# Altium schematic sheet 8Relay.SchDoc
size A1 portrait
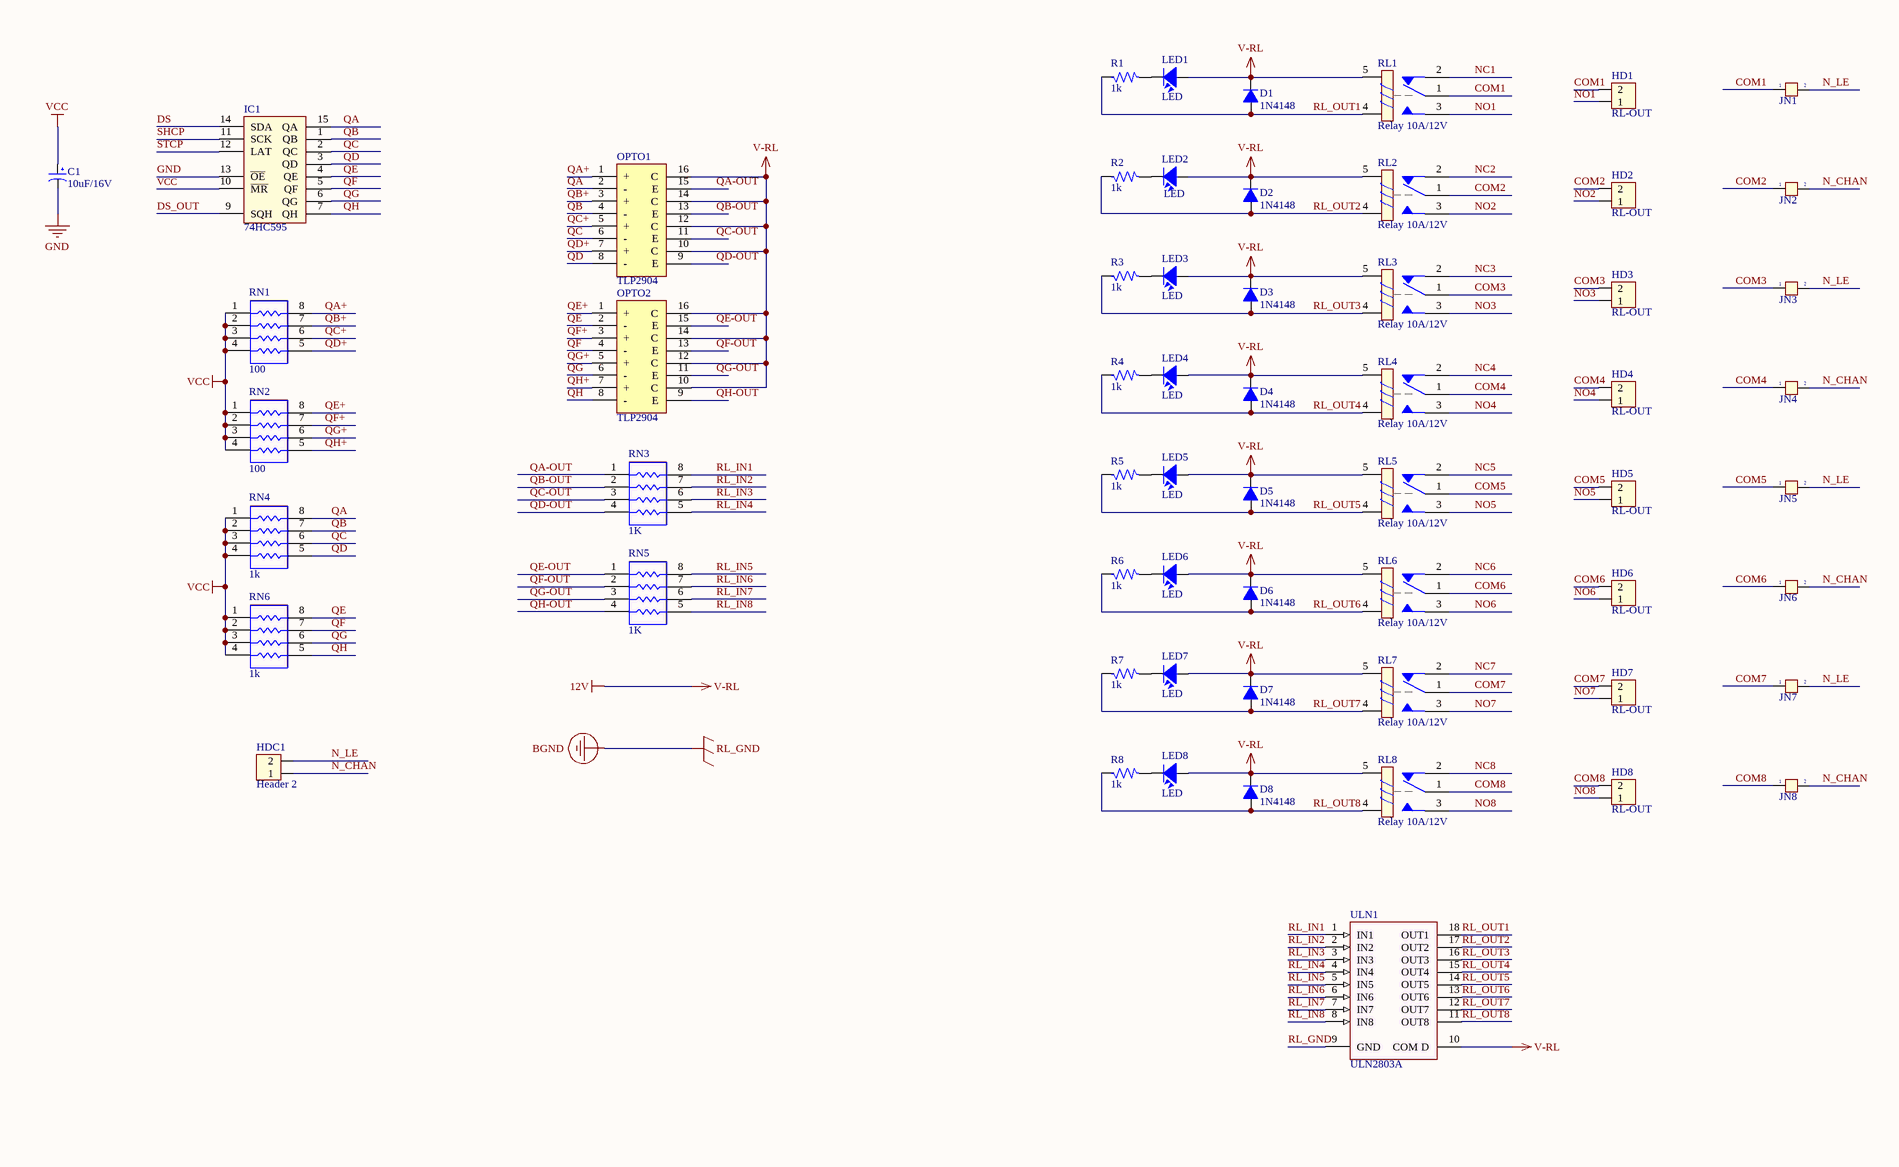
[diagram p0: 8Relay.SchDoc, top]
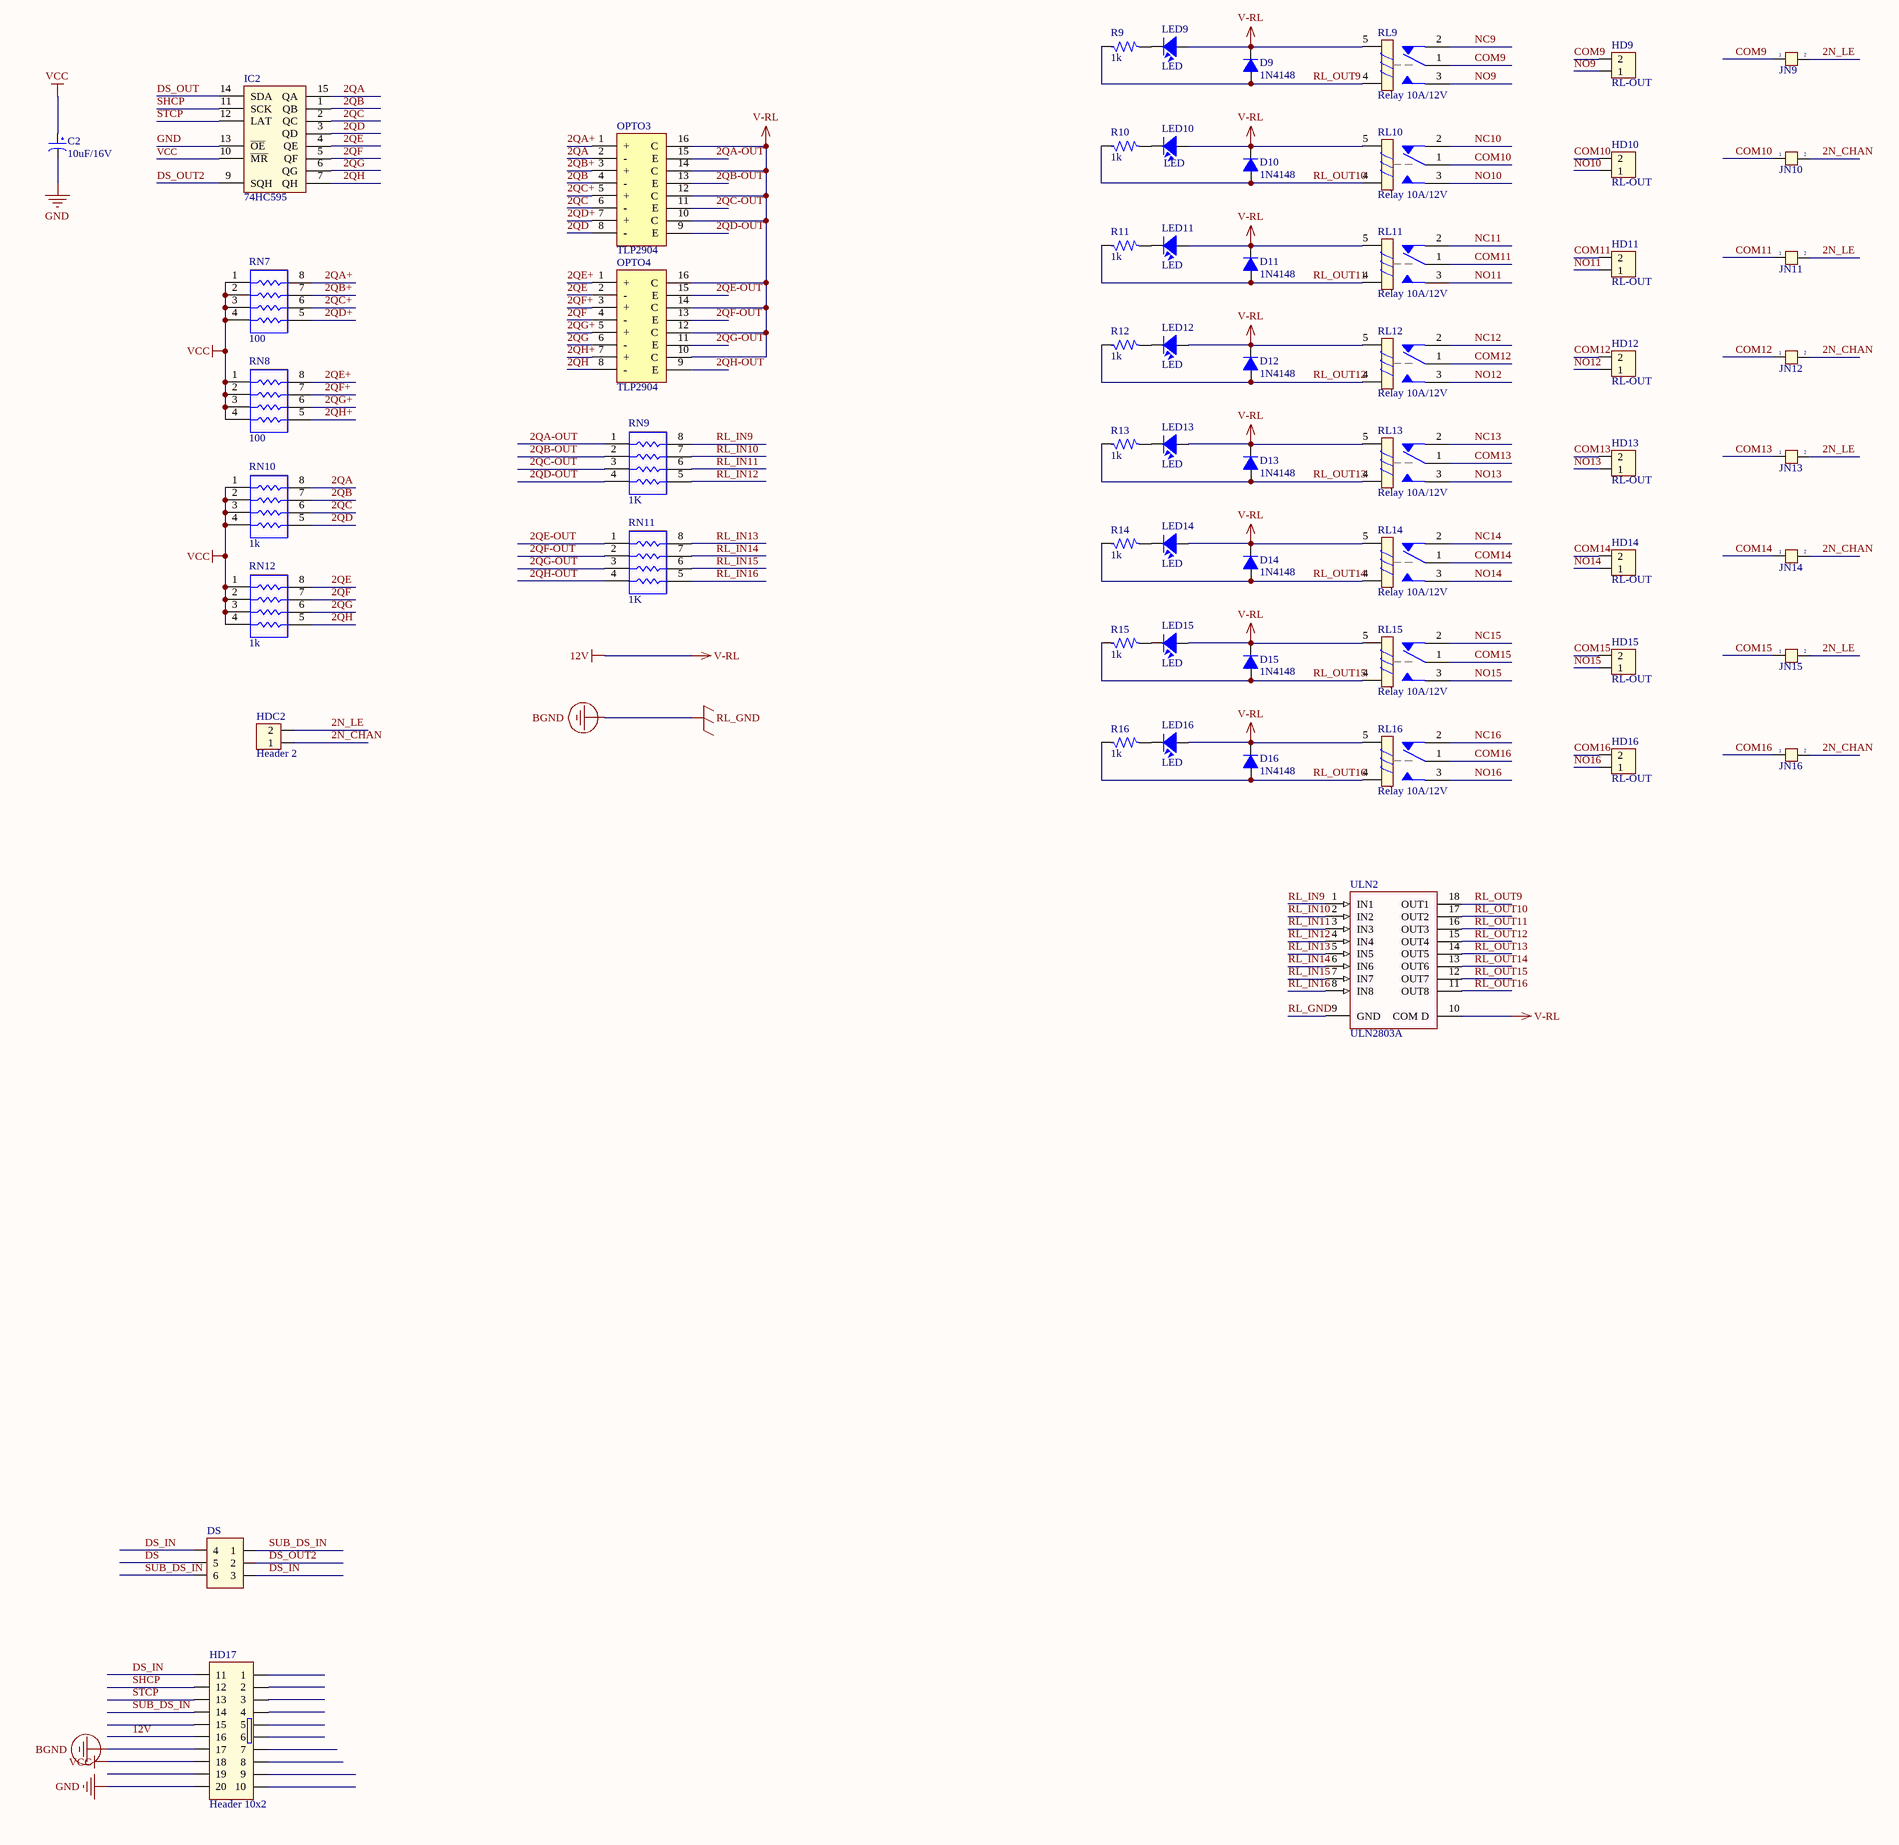
[diagram p1: 8Relay.SchDoc, bottom]

## Parts
C1  10uF/16V  [CAPMP3216X180N]
C2  10uF/16V  [CAPMP3216X180N]
D1  1N4148  [1N4148_SMD]
D2  1N4148  [1N4148_SMD]
D3  1N4148  [1N4148_SMD]
D4  1N4148  [1N4148_SMD]
D5  1N4148  [1N4148_SMD]
D6  1N4148  [1N4148_SMD]
D7  1N4148  [1N4148_SMD]
D8  1N4148  [1N4148_SMD]
D9  1N4148  [1N4148_SMD]
D10  1N4148  [1N4148_SMD]
D11  1N4148  [1N4148_SMD]
D12  1N4148  [1N4148_SMD]
D13  1N4148  [1N4148_SMD]
D14  1N4148  [1N4148_SMD]
D15  1N4148  [1N4148_SMD]
D16  1N4148  [1N4148_SMD]
DS  Connector 3x2  [JP3x2]  (value not drawn)
HD1  RL-OUT  [KF211V- 2]
HD2  RL-OUT  [KF211V- 2]
HD3  RL-OUT  [KF211V- 2]
HD4  RL-OUT  [KF211V- 2]
HD5  RL-OUT  [KF211V- 2]
HD6  RL-OUT  [KF211V- 2]
HD7  RL-OUT  [KF211V- 2]
HD8  RL-OUT  [KF211V- 2]
HD9  RL-OUT  [KF211V- 2]
HD10  RL-OUT  [KF211V- 2]
HD11  RL-OUT  [KF211V- 2]
HD12  RL-OUT  [KF211V- 2]
HD13  RL-OUT  [KF211V- 2]
HD14  RL-OUT  [KF211V- 2]
HD15  RL-OUT  [KF211V- 2]
HD16  RL-OUT  [KF211V- 2]
HD17  Header 10x2  [Hed2X10S]
HDC1  Header 2  [KF211V- 2]
HDC2  Header 2  [KF211V- 2]
IC1  74HC595  [SO-16]
IC2  74HC595  [SO-16]
JN1  Jumper 2  [JP2]  (value not drawn)
JN2  Jumper 2  [JP2]  (value not drawn)
JN3  Jumper 2  [JP2]  (value not drawn)
JN4  Jumper 2  [JP2]  (value not drawn)
JN5  Jumper 2  [JP2]  (value not drawn)
JN6  Jumper 2  [JP2]  (value not drawn)
JN7  Jumper 2  [JP2]  (value not drawn)
JN8  Jumper 2  [JP2]  (value not drawn)
JN9  Jumper 2  [JP2]  (value not drawn)
JN10  Jumper 2  [JP2]  (value not drawn)
JN11  Jumper 2  [JP2]  (value not drawn)
JN12  Jumper 2  [JP2]  (value not drawn)
JN13  Jumper 2  [JP2]  (value not drawn)
JN14  Jumper 2  [JP2]  (value not drawn)
JN15  Jumper 2  [JP2]  (value not drawn)
JN16  Jumper 2  [JP2]  (value not drawn)
LED1  LED  [LED0805]
LED2  LED  [LED0805]
LED3  LED  [LED0805]
LED4  LED  [LED0805]
LED5  LED  [LED0805]
LED6  LED  [LED0805]
LED7  LED  [LED0805]
LED8  LED  [LED0805]
LED9  LED  [LED0805]
LED10  LED  [LED0805]
LED11  LED  [LED0805]
LED12  LED  [LED0805]
LED13  LED  [LED0805]
LED14  LED  [LED0805]
LED15  LED  [LED0805]
LED16  LED  [LED0805]
OPTO1  TLP2904  [SO-16]
OPTO2  TLP2904  [SO-16]
OPTO3  TLP2904  [SO-16]
OPTO4  TLP2904  [SO-16]
R1  1k  [SM-0805]
R2  1k  [SM-0805]
R3  1k  [SM-0805]
R4  1k  [SM-0805]
R5  1k  [SM-0805]
R6  1k  [SM-0805]
R7  1k  [SM-0805]
R8  1k  [SM-0805]
R9  1k  [SM-0805]
R10  1k  [SM-0805]
R11  1k  [SM-0805]
R12  1k  [SM-0805]
R13  1k  [SM-0805]
R14  1k  [SM-0805]
R15  1k  [SM-0805]
R16  1k  [SM-0805]
RL1  Relay 10A/12V  [RL_SPDT_10A]
RL2  Relay 10A/12V  [RL_SPDT_10A]
RL3  Relay 10A/12V  [RL_SPDT_10A]
RL4  Relay 10A/12V  [RL_SPDT_10A]
RL5  Relay 10A/12V  [RL_SPDT_10A]
RL6  Relay 10A/12V  [RL_SPDT_10A]
RL7  Relay 10A/12V  [RL_SPDT_10A]
RL8  Relay 10A/12V  [RL_SPDT_10A]
RL9  Relay 10A/12V  [RL_SPDT_10A]
RL10  Relay 10A/12V  [RL_SPDT_10A]
RL11  Relay 10A/12V  [RL_SPDT_10A]
RL12  Relay 10A/12V  [RL_SPDT_10A]
RL13  Relay 10A/12V  [RL_SPDT_10A]
RL14  Relay 10A/12V  [RL_SPDT_10A]
RL15  Relay 10A/12V  [RL_SPDT_10A]
RL16  Relay 10A/12V  [RL_SPDT_10A]
RN1  100  [RES P4 Dual 0805/2012]
RN2  100  [RES P4 Dual 0805/2012]
RN3  1K  [RES P4 Dual 0805/2012]
RN4  1k  [RES P4 Dual 0805/2012]
RN5  1K  [RES P4 Dual 0805/2012]
RN6  1k  [RES P4 Dual 0805/2012]
RN7  100  [RES P4 Dual 0805/2012]
RN8  100  [RES P4 Dual 0805/2012]
RN9  1K  [RES P4 Dual 0805/2012]
RN10  1k  [RES P4 Dual 0805/2012]
RN11  1K  [RES P4 Dual 0805/2012]
RN12  1k  [RES P4 Dual 0805/2012]
ULN1  ULN2803A  [SOIC127P750X1175-18N]
ULN2  ULN2803A  [SOIC127P750X1175-18N]

## Nets
12V: D1.2(K) D2.2(K) D3.2(K) D4.2(K) D5.2(K) D6.2(K) D7.2(K) D8.2(K) D9.2(K) D10.2(K) D11.2(K) D12.2(K) D13.2(K) D14.2(K) D15.2(K) D16.2(K) HD17.16 LED1.1 LED2.1 LED3.1 LED4.1 LED5.1 LED6.1 LED7.1 LED8.1 LED9.1 LED10.1 LED11.1 LED12.1 LED13.1 LED14.1 LED15.1 LED16.1 OPTO1.10(C) OPTO1.12(C) OPTO1.14(C) OPTO1.16(C) OPTO2.10(C) OPTO2.12(C) OPTO2.14(C) OPTO2.16(C) OPTO3.10(C) OPTO3.12(C) OPTO3.14(C) OPTO3.16(C) OPTO4.10(C) OPTO4.12(C) OPTO4.14(C) OPTO4.16(C) RL1.5 RL2.5 RL3.5 RL4.5 RL5.5 RL6.5 RL7.5 RL8.5 RL9.5 RL10.5 RL11.5 RL12.5 RL13.5 RL14.5 RL15.5 RL16.5 ULN1.10(COM_D) ULN2.10(COM_D)  [also labelled V-RL]
GND: C1.2 C2.2 HD17.20 IC1.8(GND) IC1.13(~{OE}) IC2.8(GND) IC2.13(~{OE})
RL_GND: HD17.17 ULN1.9(GND) ULN2.9(GND)  [also labelled BGND]
VCC: C1.1 C2.1 HD17.18 IC1.10(~{MR}) IC1.16(VCC) IC2.10(~{MR}) IC2.16(VCC) RN1.1 RN1.2 RN1.3 RN1.4 RN2.1 RN2.2 RN2.3 RN2.4 RN4.1 RN4.2 RN4.3 RN4.4 RN6.1 RN6.2 RN6.3 RN6.4 RN7.1 RN7.2 RN7.3 RN7.4 RN8.1 RN8.2 RN8.3 RN8.4 RN10.1 RN10.2 RN10.3 RN10.4 RN12.1 RN12.2 RN12.3 RN12.4
2N_CHAN: HDC2.1 JN10.2 JN12.2 JN14.2 JN16.2
2N_LE: HDC2.2 JN9.2 JN11.2 JN13.2 JN15.2
2QA: IC2.15(QA) OPTO3.2(-) RN10.8
2QA+: OPTO3.1(+) RN7.8
2QA-OUT: OPTO3.15(E) RN9.1
2QB: IC2.1(QB) OPTO3.4(-) RN10.7
2QB+: OPTO3.3(+) RN7.7
2QB-OUT: OPTO3.13(E) RN9.2
2QC: IC2.2(QC) OPTO3.6(-) RN10.6
2QC+: OPTO3.5(+) RN7.6
2QC-OUT: OPTO3.11(E) RN9.3
2QD: IC2.3(QD) OPTO3.8(-) RN10.5
2QD+: OPTO3.7(+) RN7.5
2QD-OUT: OPTO3.9(E) RN9.4
2QE: IC2.4(QE) OPTO4.2(-) RN12.8
2QE+: OPTO4.1(+) RN8.8
2QE-OUT: OPTO4.15(E) RN11.1
2QF: IC2.5(QF) OPTO4.4(-) RN12.7
2QF+: OPTO4.3(+) RN8.7
2QF-OUT: OPTO4.13(E) RN11.2
2QG: IC2.6(QG) OPTO4.6(-) RN12.6
2QG+: OPTO4.5(+) RN8.6
2QG-OUT: OPTO4.11(E) RN11.3
2QH: IC2.7(QH) OPTO4.8(-) RN12.5
2QH+: OPTO4.7(+) RN8.5
2QH-OUT: OPTO4.9(E) RN11.4
COM1: HD1.2 JN1.1 RL1.1
COM2: HD2.2 JN2.1 RL2.1
COM3: HD3.2 JN3.1 RL3.1
COM4: HD4.2 JN4.1 RL4.1
COM5: HD5.2 JN5.1 RL5.1
COM6: HD6.2 JN6.1 RL6.1
COM7: HD7.2 JN7.1 RL7.1
COM8: HD8.2 JN8.1 RL8.1
COM9: HD9.2 JN9.1 RL9.1
COM10: HD10.2 JN10.1 RL10.1
COM11: HD11.2 JN11.1 RL11.1
COM12: HD12.2 JN12.1 RL12.1
COM13: HD13.2 JN13.1 RL13.1
COM14: HD14.2 JN14.1 RL14.1
COM15: HD15.2 JN15.1 RL15.1
COM16: HD16.2 JN16.1 RL16.1
DS: DS.5 IC1.14(SDA)
DS_IN: DS.3 DS.4 HD17.11
DS_OUT: IC1.9(SQH) IC2.14(SDA)
DS_OUT2: DS.2 IC2.9(SQH)
N_CHAN: HDC1.1 JN2.2 JN4.2 JN6.2 JN8.2
N_LE: HDC1.2 JN1.2 JN3.2 JN5.2 JN7.2
NC1: RL1.2
NC2: RL2.2
NC3: RL3.2
NC4: RL4.2
NC5: RL5.2
NC6: RL6.2
NC7: RL7.2
NC8: RL8.2
NC9: RL9.2
NC10: RL10.2
NC11: RL11.2
NC12: RL12.2
NC13: RL13.2
NC14: RL14.2
NC15: RL15.2
NC16: RL16.2
NO1: HD1.1 RL1.3
NO2: HD2.1 RL2.3
NO3: HD3.1 RL3.3
NO4: HD4.1 RL4.3
NO5: HD5.1 RL5.3
NO6: HD6.1 RL6.3
NO7: HD7.1 RL7.3
NO8: HD8.1 RL8.3
NO9: HD9.1 RL9.3
NO10: HD10.1 RL10.3
NO11: HD11.1 RL11.3
NO12: HD12.1 RL12.3
NO13: HD13.1 RL13.3
NO14: HD14.1 RL14.3
NO15: HD15.1 RL15.3
NO16: HD16.1 RL16.3
QA: IC1.15(QA) OPTO1.2(-) RN4.8
QA+: OPTO1.1(+) RN1.8
QA-OUT: OPTO1.15(E) RN3.1
QB: IC1.1(QB) OPTO1.4(-) RN4.7
QB+: OPTO1.3(+) RN1.7
QB-OUT: OPTO1.13(E) RN3.2
QC: IC1.2(QC) OPTO1.6(-) RN4.6
QC+: OPTO1.5(+) RN1.6
QC-OUT: OPTO1.11(E) RN3.3
QD: IC1.3(QD) OPTO1.8(-) RN4.5
QD+: OPTO1.7(+) RN1.5
QD-OUT: OPTO1.9(E) RN3.4
QE: IC1.4(QE) OPTO2.2(-) RN6.8
QE+: OPTO2.1(+) RN2.8
QE-OUT: OPTO2.15(E) RN5.1
QF: IC1.5(QF) OPTO2.4(-) RN6.7
QF+: OPTO2.3(+) RN2.7
QF-OUT: OPTO2.13(E) RN5.2
QG: IC1.6(QG) OPTO2.6(-) RN6.6
QG+: OPTO2.5(+) RN2.6
QG-OUT: OPTO2.11(E) RN5.3
QH: IC1.7(QH) OPTO2.8(-) RN6.5
QH+: OPTO2.7(+) RN2.5
QH-OUT: OPTO2.9(E) RN5.4
RL_IN1: RN3.8 ULN1.1(IN1)
RL_IN2: RN3.7 ULN1.2(IN2)
RL_IN3: RN3.6 ULN1.3(IN3)
RL_IN4: RN3.5 ULN1.4(IN4)
RL_IN5: RN5.8 ULN1.5(IN5)
RL_IN6: RN5.7 ULN1.6(IN6)
RL_IN7: RN5.6 ULN1.7(IN7)
RL_IN8: RN5.5 ULN1.8(IN8)
RL_IN9: RN9.8 ULN2.1(IN1)
RL_IN10: RN9.7 ULN2.2(IN2)
RL_IN11: RN9.6 ULN2.3(IN3)
RL_IN12: RN9.5 ULN2.4(IN4)
RL_IN13: RN11.8 ULN2.5(IN5)
RL_IN14: RN11.7 ULN2.6(IN6)
RL_IN15: RN11.6 ULN2.7(IN7)
RL_IN16: RN11.5 ULN2.8(IN8)
RL_OUT1: D1.1(A) R1.1 RL1.4 ULN1.18(OUT1)
RL_OUT2: D2.1(A) R2.1 RL2.4 ULN1.17(OUT2)
RL_OUT3: D3.1(A) R3.1 RL3.4 ULN1.16(OUT3)
RL_OUT4: D4.1(A) R4.1 RL4.4 ULN1.15(OUT4)
RL_OUT5: D5.1(A) R5.1 RL5.4 ULN1.14(OUT5)
RL_OUT6: D6.1(A) R6.1 RL6.4 ULN1.13(OUT6)
RL_OUT7: D7.1(A) R7.1 RL7.4 ULN1.12(OUT7)
RL_OUT8: D8.1(A) R8.1 RL8.4 ULN1.11(OUT8)
RL_OUT9: D9.1(A) R9.1 RL9.4 ULN2.18(OUT1)
RL_OUT10: D10.1(A) R10.1 RL10.4 ULN2.17(OUT2)
RL_OUT11: D11.1(A) R11.1 RL11.4 ULN2.16(OUT3)
RL_OUT12: D12.1(A) R12.1 RL12.4 ULN2.15(OUT4)
RL_OUT13: D13.1(A) R13.1 RL13.4 ULN2.14(OUT5)
RL_OUT14: D14.1(A) R14.1 RL14.4 ULN2.13(OUT6)
RL_OUT15: D15.1(A) R15.1 RL15.4 ULN2.12(OUT7)
RL_OUT16: D16.1(A) R16.1 RL16.4 ULN2.11(OUT8)
SHCP: HD17.12 IC1.11(SCK) IC2.11(SCK)
STCP: HD17.13 IC1.12(LAT) IC2.12(LAT)
SUB_DS_IN: DS.1 DS.6 HD17.14
NetLED1_2: LED1.2 R1.2
NetLED2_2: LED2.2 R2.2
NetLED3_2: LED3.2 R3.2
NetLED4_2: LED4.2 R4.2
NetLED5_2: LED5.2 R5.2
NetLED6_2: LED6.2 R6.2
NetLED7_2: LED7.2 R7.2
NetLED8_2: LED8.2 R8.2
NetLED9_2: LED9.2 R9.2
NetLED10_2: LED10.2 R10.2
NetLED11_2: LED11.2 R11.2
NetLED12_2: LED12.2 R12.2
NetLED13_2: LED13.2 R13.2
NetLED14_2: LED14.2 R14.2
NetLED15_2: LED15.2 R15.2
NetLED16_2: LED16.2 R16.2

Not connected (* = marked no-connect by the designer): HD17 1 2 3 4 5 6 7 8 9 10 15 19

## Notes on the sheet
- Title
- Size:
- Date:
- File:
- A1
- Number:
- Time:
- Revision:
- Sheet
- of

## Library data of the parts
C1 C2 = CP3: Cap 100uF/35V - 470uF/16V; Value: 100uF/35V/50V; Description 1: 1000uF/6,3V - 470uF/16V - 330uF - 25V; Description 2: 220uF/35V - 100uF/50V - 63V - 4,7uF/200V; Description 3: 22uF => 33uF100V - 3,3uF => 4,7uF/250V; Description 4: 2,2uF =>3,3uF/350 - 2,2uF/400V - 1uF/450V
D1-D16 = D1A: Diode 1A; Value: 1N4007
DS = JP3x2: Value: Connector 3x2
HD1-HD16 HDC1 HDC2 = Hed2: Header 2 (Green); Value: Header 2
HD17 = HED10X2: Value: Header 5x2
IC1 IC2 = 74595: 8 Bit Serial input - Parallel Output; Value: 74HC595
JN1-JN16 = JP 2: Value: JP 2
LED1-LED16 = LED: LED Single colour Green and Red; Value: LED 3 ly Single Colour
OPTO1-OPTO4 = PC817 x 4: PC817 OPTO
R1-R16 = R: Resistor 1/4W; Value: R1/4W - 1K
RL1-RL16 = Relay 1: Relay SPDT,10A - 12VDC 5 Pin; Value: Relay SPDT, 10A, 12V
RN1-RN12 = Respack 4 Dual: Value: 10K
ULN1 ULN2 = ULN2803A: High-Voltage, High-Current Darlington Array